# EAGLE design lightbarrier_breakout (EAGLE 6.6.0)
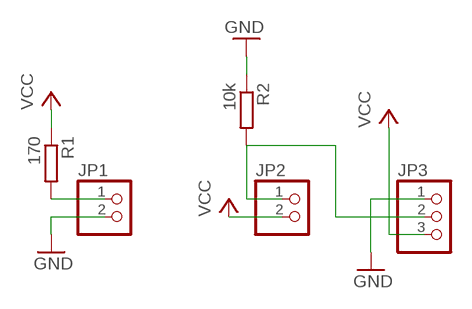
[diagram p0: schematic, sheet 1]

## Parts
JP1  PINHD-1X2  [1X02]
JP2  PINHD-1X2  [1X02]
JP3  PINHD-1X3/90  [1X03/90]
R1  170  R-EU_R0805  [R0805]
R2  10k  R-EU_R0805  [R0805]

## Nets
GND: JP1.2 JP3.1 R2.1
N$1: JP1.1 R1.2
N$2: JP2.1 JP3.2 R2.2
VCC: JP2.2 JP3.3 R1.1

## Library data of the parts
JP1 JP2 = pinhead:PINHD-1X2: PIN HEADER
JP3 = pinhead:PINHD-1X3: PIN HEADER
R1 R2 = rcl:R-EU_: RESISTOR, European symbol

## Board
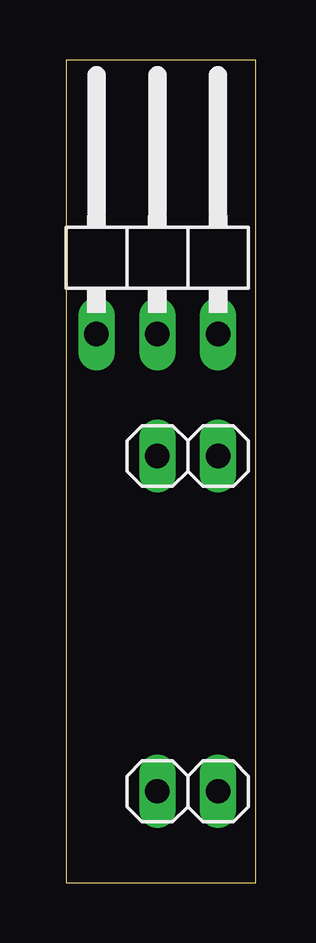
[diagram p1: board, top side]
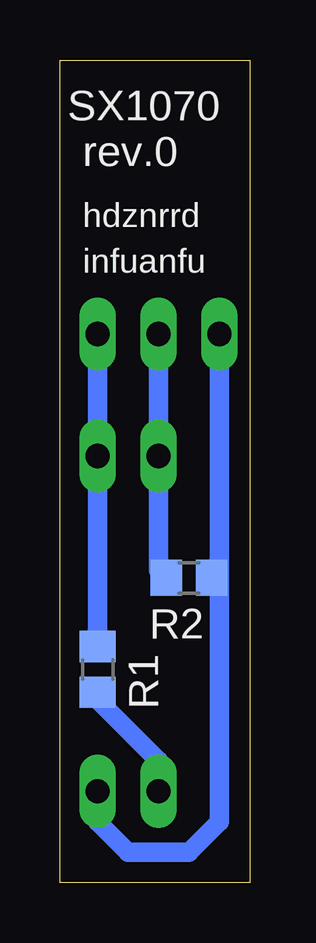
[diagram p2: board, bottom side, seen from below]

Size 7.92 x 34.28 mm. Coordinates in mm from the lower left corner, seen from the top.
Outline: 0,0 7.92,0 7.92,34.28 0,34.28 0,0
Copper layers (1*16): Top 0.035mm / dielectric 1.5mm / Bottom 0.035mm
Design rules "default": minimum track width 10mil, minimum drill 24mil, track to track 8mil, track to pad 8mil, pad to pad 8mil, via to via 8mil, smd to smd 8mil, copper to edge 40mil, drill to drill 8mil, minimum pad ring 10mil, minimum via ring 8mil, stop-mask expansion 4mil, vias tented up to drill 0mil, thermal gap 10mil

### Footprints (pad centres in the part's own frame; a part is rotated, then mirrored left to right if it is on the bottom)
1X02 = drill 1.016 long: 1 -1.27,0; 2 1.27,0
1X03/90 = drill 1.016 long: 1 -2.54,-3.81; 2 0,-3.81; 3 2.54,-3.81
R0805 = smd 1.3 x 1.5: 1 -0.95,0; 2 0.95,0

### Placement (x,y rotation side)
JP1  5.08,3.81 0 top
JP2  5.08,17.78 0 top
JP3  3.81,26.67 0 top
R1  6.35,8.89 270 bottom
R2  2.54,12.7 180 bottom

### Tracks (layer width: path | path; a pad name or v marks a point on that pad's centre or on a via)
GND
  Bottom 0.813: JP1.2 6.35,2.54 5.08,1.27 2.54,1.27 1.27,2.54 1.27,12.7 | 1.27,12.7 JP3.1 | R2.1 1.27,12.7
N$1
  Bottom 0.406: R1.2 6.35,7.62
  Bottom 0.813: 6.35,7.62 3.81,5.08 JP1.1
N$2
  Bottom 0.813: JP3.2 JP2.1 3.81,13.02 R2.2
VCC
  Bottom 0.813: JP3.3 JP2.2 R1.1

### Text on the board
bNames: SX1070 | rev.0 | hdznrrd | infuanfu